# EAGLE schematic PWM (EAGLE 7.1.0)
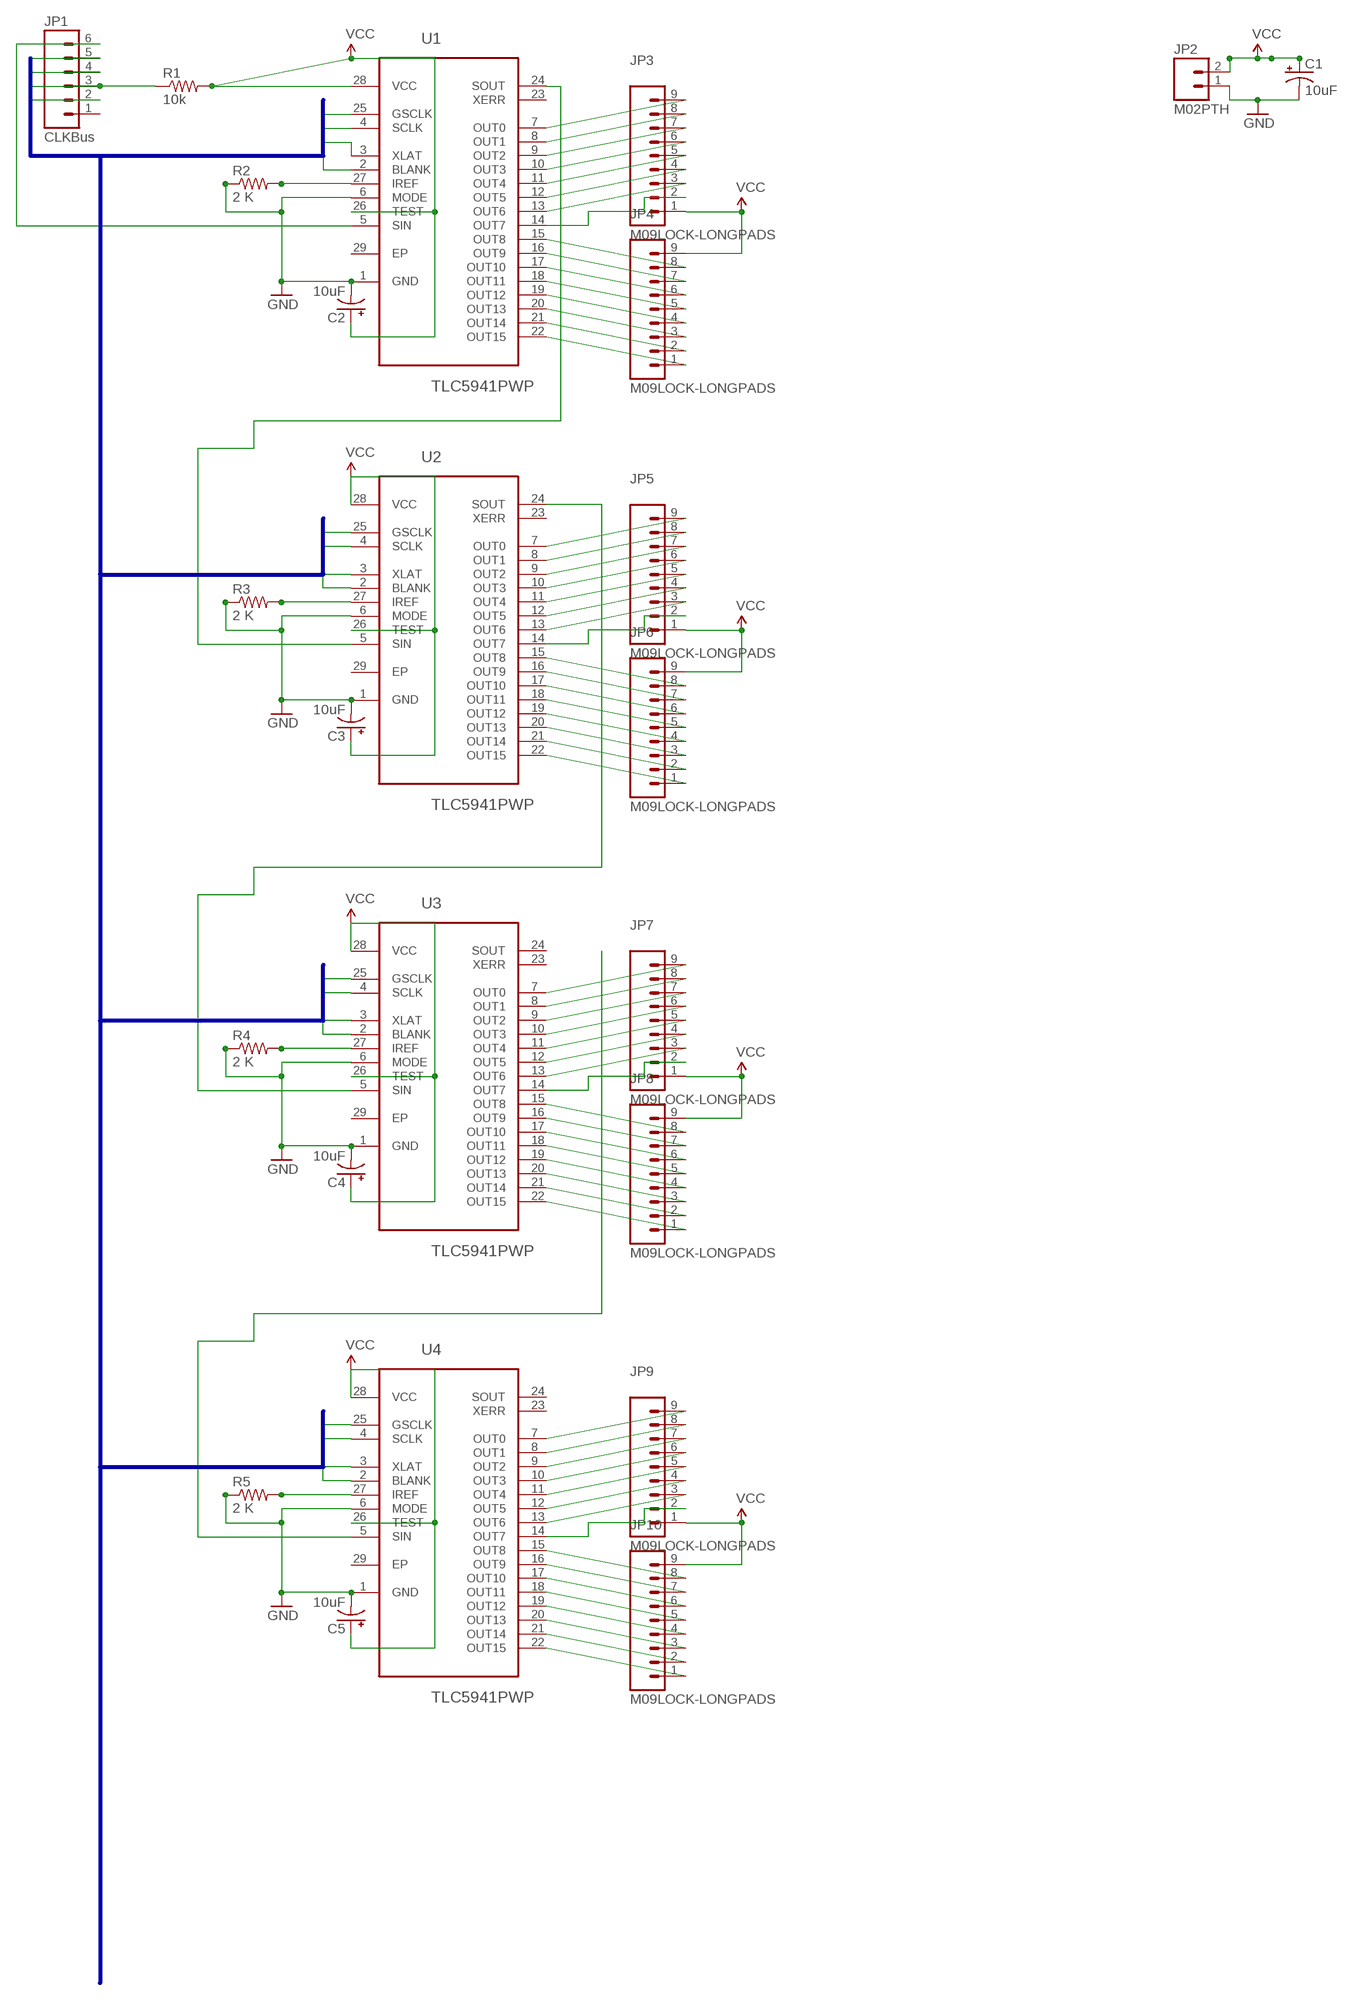
[diagram p0: schematic, sheet 1]

## Parts
C1  10uF  CAP_POLPTH2  [CPOL-RADIAL-10UF-25V]
C2  10uF  CAP_POLPTH2  [CPOL-RADIAL-10UF-25V]
C3  10uF  CAP_POLPTH2  [CPOL-RADIAL-10UF-25V]
C4  10uF  CAP_POLPTH2  [CPOL-RADIAL-10UF-25V]
C5  10uF  CAP_POLPTH2  [CPOL-RADIAL-10UF-25V]
JP1  CLKBus  M06LOCK_LONGPADS  [1X06_LOCK_LONGPADS]
JP2  M02PTH  [1X02]
JP3  M09LOCK-LONGPADS  [1X09_LOCK_LONGPADS]
JP4  M09LOCK-LONGPADS  [1X09_LOCK_LONGPADS]
JP5  M09LOCK-LONGPADS  [1X09_LOCK_LONGPADS]
JP6  M09LOCK-LONGPADS  [1X09_LOCK_LONGPADS]
JP7  M09LOCK-LONGPADS  [1X09_LOCK_LONGPADS]
JP8  M09LOCK-LONGPADS  [1X09_LOCK_LONGPADS]
JP9  M09LOCK-LONGPADS  [1X09_LOCK_LONGPADS]
JP10  M09LOCK-LONGPADS  [1X09_LOCK_LONGPADS]
R1  10k  10KOHM-1/4W-1%(PTH)HORIZ  [AXIAL-0.3]
R2  2 K  1KOHM1/4W5%(PTH)  [AXIAL-0.3]
R3  2 K  1KOHM1/4W5%(PTH)  [AXIAL-0.3]
R4  2 K  1KOHM1/4W5%(PTH)  [AXIAL-0.3]
R5  2 K  1KOHM1/4W5%(PTH)  [AXIAL-0.3]
U1  TLC5941PWP  [SOP65P640X120-29N]
U2  TLC5941PWP  [SOP65P640X120-29N]
U3  TLC5941PWP  [SOP65P640X120-29N]
U4  TLC5941PWP  [SOP65P640X120-29N]

## Nets
BLANK: JP1.3 R1.P$1 U1.2(BLANK) U2.2(BLANK) U3.2(BLANK) U4.2(BLANK)
GND: C1.2(-) C2.2(-) C3.2(-) C4.2(-) C5.2(-) JP2.1 R2.P$1 R3.P$1 R4.P$1 R5.P$1 U1.1(GND) U1.6(MODE) U2.1(GND) U2.6(MODE) U3.1(GND) U3.6(MODE) U4.1(GND) U4.6(MODE)
GSCLK: JP1.2 U1.25(GSCLK) U2.25(GSCLK) U3.25(GSCLK) U4.25(GSCLK)
N$1: JP4.1 U1.22(OUT15)
N$2: JP3.2 U1.14(OUT7)
N$3: JP3.3 U1.13(OUT6)
N$4: JP3.4 U1.12(OUT5)
N$5: JP3.5 U1.11(OUT4)
N$6: JP3.6 U1.10(OUT3)
N$7: JP3.7 U1.9(OUT2)
N$8: JP3.8 U1.8(OUT1)
N$9: JP3.9 U1.7(OUT0)
N$10: JP4.2 U1.21(OUT14)
N$11: JP4.3 U1.20(OUT13)
N$12: JP4.4 U1.19(OUT12)
N$13: JP4.5 U1.18(OUT11)
N$14: JP4.6 U1.17(OUT10)
N$15: JP4.7 U1.16(OUT9)
N$16: JP4.8 U1.15(OUT8)
N$19: R2.P$2 U1.27(IREF)
N$24: R3.P$2 U2.27(IREF)
N$25: JP5.3 U2.13(OUT6)
N$26: JP5.4 U2.12(OUT5)
N$27: JP5.5 U2.11(OUT4)
N$28: JP5.6 U2.10(OUT3)
N$29: JP5.7 U2.9(OUT2)
N$30: JP5.8 U2.8(OUT1)
N$31: JP5.9 U2.7(OUT0)
N$32: JP6.1 U2.22(OUT15)
N$33: JP6.2 U2.21(OUT14)
N$34: JP6.3 U2.20(OUT13)
N$35: JP6.4 U2.19(OUT12)
N$36: JP6.5 U2.18(OUT11)
N$37: JP6.6 U2.17(OUT10)
N$38: JP6.7 U2.16(OUT9)
N$39: JP6.8 U2.15(OUT8)
N$40: JP5.2 U2.14(OUT7)
N$44: R4.P$2 U3.27(IREF)
N$46: JP7.3 U3.13(OUT6)
N$47: JP7.4 U3.12(OUT5)
N$48: JP7.5 U3.11(OUT4)
N$49: JP7.6 U3.10(OUT3)
N$50: JP7.7 U3.9(OUT2)
N$51: JP7.8 U3.8(OUT1)
N$52: JP7.9 U3.7(OUT0)
N$53: JP8.1 U3.22(OUT15)
N$54: JP8.2 U3.21(OUT14)
N$55: JP8.3 U3.20(OUT13)
N$56: JP8.4 U3.19(OUT12)
N$57: JP8.5 U3.18(OUT11)
N$58: JP8.6 U3.17(OUT10)
N$59: JP8.7 U3.16(OUT9)
N$60: JP8.8 U3.15(OUT8)
N$61: JP7.2 U3.14(OUT7)
N$62: R5.P$2 U4.27(IREF)
N$63: JP9.3 U4.13(OUT6)
N$64: JP9.4 U4.12(OUT5)
N$65: JP9.5 U4.11(OUT4)
N$66: JP9.6 U4.10(OUT3)
N$67: JP9.7 U4.9(OUT2)
N$68: JP9.8 U4.8(OUT1)
N$69: JP9.9 U4.7(OUT0)
N$70: JP10.1 U4.22(OUT15)
N$71: JP10.2 U4.21(OUT14)
N$72: JP10.3 U4.20(OUT13)
N$73: JP10.4 U4.19(OUT12)
N$74: JP10.5 U4.18(OUT11)
N$75: JP10.6 U4.17(OUT10)
N$76: JP10.7 U4.16(OUT9)
N$77: JP10.8 U4.15(OUT8)
N$78: JP9.2 U4.14(OUT7)
SCLK: JP1.5 U1.4(SCLK) U2.4(SCLK) U3.4(SCLK) U4.4(SCLK)
SIN0: JP1.6 U1.5(SIN)
SIN1: U1.24(SOUT) U2.5(SIN)
SIN2: U2.24(SOUT) U3.5(SIN)
SIN3: U4.5(SIN)
VCC: C1.1(+) C2.1(+) C3.1(+) C4.1(+) C5.1(+) JP2.2 JP3.1 JP4.9 JP5.1 JP6.9 JP7.1 JP8.9 JP9.1 JP10.9 R1.P$2 U1.26(TEST) U1.28(VCC) U2.26(TEST) U2.28(VCC) U3.26(TEST) U3.28(VCC) U4.26(TEST) U4.28(VCC)
XLAT: JP1.4 U1.3(XLAT) U2.3(XLAT) U3.3(XLAT) U4.3(XLAT)
Unconnected: JP1.1 U1.23(XERR) U1.29(EP) U2.23(XERR) U2.29(EP) U3.23(XERR) U3.24(SOUT) U3.29(EP) U4.23(XERR) U4.24(SOUT) U4.29(EP)

## Buses
CLKBUS:GSCLK,SCLK,XLAT,BLANK

## Library data of the parts
C1-C5 = SparkFun-Capacitors:CAP_POL: Capacitor Polarized These are standard SMD and PTH capacitors. Normally 10uF, 47uF, and 100uF in electrolytic and tantalum varieties. Always verify the external diameter of the through hole cap, it varies with capacity, voltage, and manufacturer. The EIA devices should be standard.
JP1 = SparkFun-Connectors:M06: Header 6 Standard 6-pin 0.1" header. Use with straight break away headers (SKU : PRT-00116), right angle break away headers (PRT-00553), swiss pins (PRT-00743), machine pins (PRT-00117), and female headers (PRT-00115). Molex polarized connector foot print use with SKU : PRT-08094 with associated crimp pins and housings. NOTES ON THE VARIANTS LOCK and LOCK_LONGPADS... This footprint was designed to help hold the alignment of a through-hole component (i.e. 6-pin header) while soldering it into place. You may notice that each hole has been shifted either up or down by 0.005 of an inch from it's more standard position (which is a perfectly straight line). This slight alteration caused the pins (the squares in the middle) to touch the edges of the holes. Because they are alternating, it causes a "brace" to hold the component in place. 0.005 has proven to be the perfect amount of "off-center" position when using our standard breakaway headers. Although looks a little odd when you look at the bare footprint, once you have a header in there, the alteration is very hard to notice. Also,if you push a header all the way into place, it is covered up entirely on the bottom side. This idea of altering the position of holes to aid alignment will be further integrated into the Sparkfun Library for other footprints. It can help hold any component with 3 or more connection pins.
JP2 = SparkFun-Connectors:M02: Standard 2-pin 0.1" header. Use with - straight break away headers ( PRT-00116) - right angle break away headers (PRT-00553) - swiss pins (PRT-00743) - machine pins (PRT-00117) - female headers (PRT-00115) Molex polarized connector foot print use with: PRT-08233 with associated crimp pins and housings. 2.54_SCREWTERM for use with PRT-10571. 3.5mm Screw Terminal footprints for PRT-08084 5mm Screw Terminal footprints for use with PRT-08432
JP3-JP10 = SparkFun-Connectors:M09: Header 9 Standard 9-pin 0.1" header. Use with straight break away headers (SKU : PRT-00116), right angle break away headers (PRT-00553), swiss pins (PRT-00743), machine pins (PRT-00117), and female headers (PRT-00115).
R1 = SparkFun-Resistors:10KOHM-1/4W-1%(PTH): RES-12183; PROD_ID: RES-12183
R2-R5 = SparkFun-Resistors:1KOHM1/4W5%(PTH): RES-08380; PROD_ID: RES-08380; VALE: 1k
U1-U4 = Texas Instruments_By_element14_Batch_1:TLC5941PWP: 16-CHANNEL LED DRIVER WITH DOT CORRECTION AND GRAYSCALE PWM CONTROL; MPN: TLC5941PWP; OC_FARNELL: 1226308; OC_NEWARK: 58K6744; PACKAGE: HTSSOP-28; SUPPLIER: Texas Instruments